# EAGLE design NJM2936+MAU106_PSU (EAGLE 7.2.0)
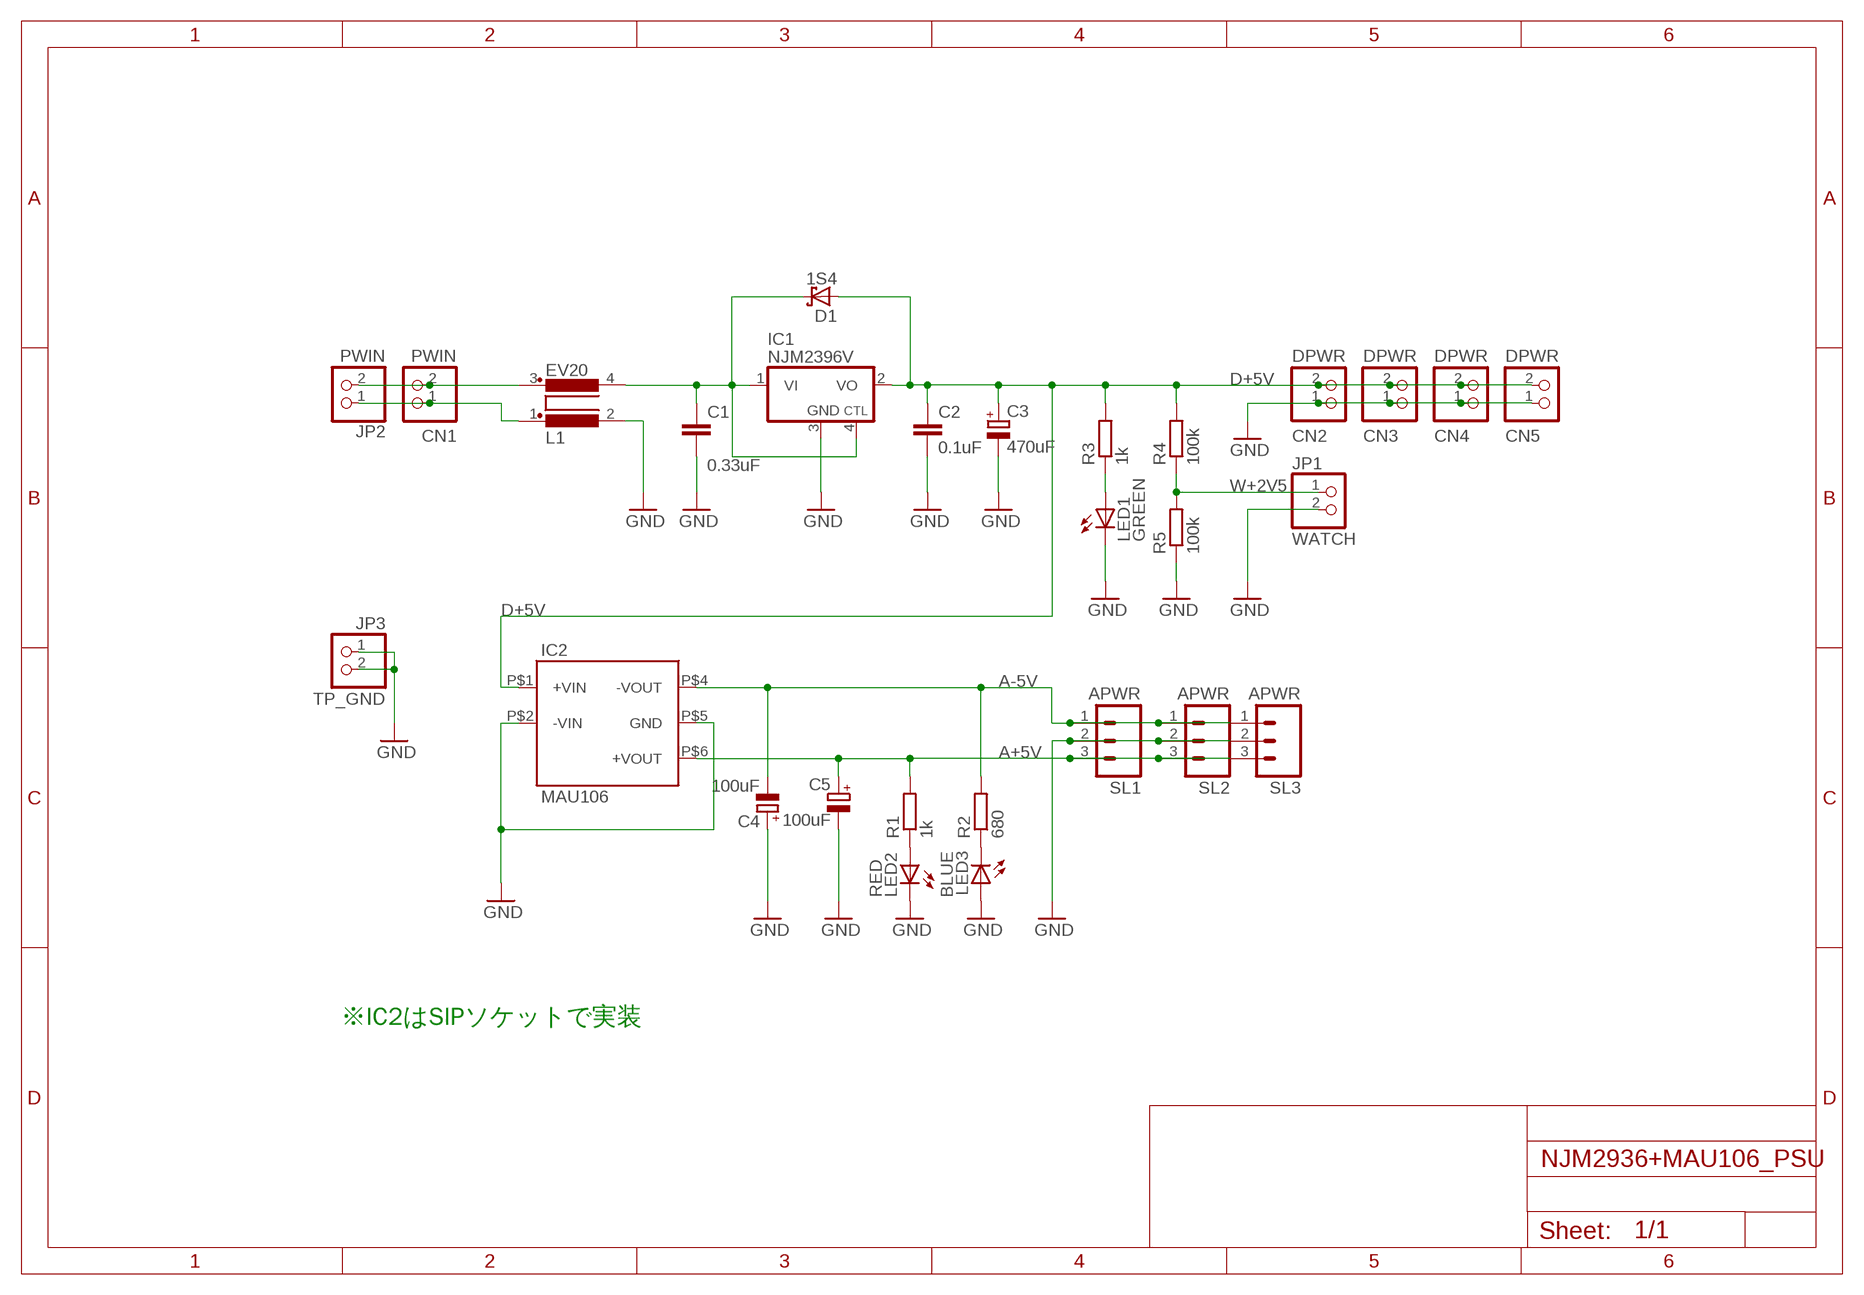
[diagram p0: schematic, sheet 1]

## Parts
C1  0.33uF  C-EU050-030X075  [C050-030X075]
C2  0.1uF  C-EU025-024X044  [C025-024X044]
C3  470uF  CPOL-EUSANYO_F13  [SANYO-OSCON_F13]
C4  100uF  CPOL-EUSANYO_C6  [SANYO-OSCON_C6]
C5  100uF  CPOL-EUSANYO_C6  [SANYO-OSCON_C6]
CN1  PWIN  B2B-XH-A  [B2B-XH-A]
CN2  DPWR  B2B-XH-A  [B2B-XH-A]
CN3  DPWR  B2B-XH-A  [B2B-XH-A]
CN4  DPWR  B2B-XH-A  [B2B-XH-A]
CN5  DPWR  B2B-XH-A  [B2B-XH-A]
D1  1S4  SCHOTTKY-DIODEDO35-7  [DO35-7]
IC1  NJM2396V  [TO220-4V]
IC2  MAU106  [MAU106]
JP1  WATCH  PINHD-1X2  [1X02]
JP2  PWIN  PINHD-1X2  [1X02]
JP3  TP_GND  PINHD-1X2  [1X02]
L1  EV20  [EV20]
LED1  GREEN  LED3MM  [LED3MM]
LED2  RED  LED3MM  [LED3MM]
LED3  BLUE  LED3MM  [LED3MM]
R1  1k  R-EU_0207/7  [0207/7]
R2  680  R-EU_0207/7  [0207/7]
R3  1k  R-EU_0207/7  [0207/7]
R4  100k  R-EU_0207/7  [0207/7]
R5  100k  R-EU_0207/7  [0207/7]
SL1  APWR  M03  [03P]
SL2  APWR  M03  [03P]
SL3  APWR  M03  [03P]

## Nets
A+5V: C5.+ IC2.P$6(+VOUT) R1.2 SL1.3 SL2.3 SL3.3
A-5V: C4.- IC2.P$4(-VOUT) R2.2 SL1.1 SL2.1 SL3.1
D+5V: C2.1 C3.+ CN2.2 CN3.2 CN4.2 CN5.2 D1.A IC1.2(VO) IC2.P$1(+VIN) R3.2 R4.2
GND: C1.2 C2.2 C3.- C4.+ C5.- CN2.1 CN3.1 CN4.1 CN5.1 IC1.3(GND) IC2.P$2(-VIN) IC2.P$5(GND) JP1.2 JP3.1 JP3.2 L1.2 LED1.K(C) LED2.K(C) LED3.A R5.1 SL1.2 SL2.2 SL3.2
N$1: CN1.2 JP2.2 L1.3
N$2: C1.1 D1.C IC1.1(VI) IC1.4(CTL) L1.4
N$3: CN1.1 JP2.1 L1.1
N$5: LED1.A R3.1
N$9: LED2.A R1.1
N$10: LED3.K(C) R2.1
W+2V5: JP1.1 R4.1 R5.2

## Notes on the sheet
- ※IC2はSIPソケットで実装

## Library data of the parts
C1 C2 = rcl:C-EU: CAPACITOR, European symbol
C3-C5 = rcl:CPOL-EU: POLARIZED CAPACITOR, European symbol
CN1-CN5 = jst-xh:B2B-XH-A: Wire-to-Board 2.5mm pitch top mount connector Source: http://www.jst-mfg.com/product/pdf/jpn/XH.pdf http://www.jst-mfg.com/product/detail.php?series=277
D1 = diode:SCHOTTKY-DIODE: Schottky Diode
IC1 = mylib2:NJM2396V: NJM2936 Vertical 5V LDO
IC2 = mylib2:MAU106: MAU106 Minmax MAU106 Dual Output DC/DC Converter
JP1-JP3 = pinhead:PINHD-1X2: PIN HEADER
L1 = mylib2:EV20: EV20 Schaffner Common-mode Choke
LED1-LED3 = led:LED: LED OSRAM: - CHIPLED LG R971, LG N971, LY N971, LG Q971, LY Q971, LO R971, LY R971 LH N974, LH R974 LS Q976, LO Q976, LY Q976 LO Q996 - Hyper CHIPLED LW Q18S LB Q993, LB Q99A, LB R99A - SideLED LS A670, LO A670, LY A670, LG A670, LP A670 LB A673, LV A673, LT A673, LW A673 LH A674 LY A675 LS A676, LA A676, LO A676, LY A676, LW A676 LS A679, LY A679, LG A679 - Hyper Micro SIDELED® LS Y876, LA Y876, LO Y876, LY Y876 LT Y87S - SmartLED LW L88C, LW L88S LB L89C, LB L89S, LG L890 LS L89K, LO L89K, LY L89K LS L896, LA L896, LO L896, LY L896 - TOPLED LS T670, LO T670, LY T670, LG T670, LP T670 LSG T670, LSP T670, LSY T670, LOP T670, LYG T670 LG T671, LOG T671, LSG T671 LB T673, LV T673, LT T673, LW T673 LH T674 LS T676, LA T676, LO T676, LY T676, LB T676, LH T676, LSB T676, LW T676 LB T67C, LV T67C, LT T67C, LS T67K, LO T67K, LY T67K, LW E67C LS E67B, LA E67B, LO E67B, LY E67B, LB E67C, LV E67C, LT E67C LW T67C LS T679, LY T679, LG T679 LS T770, LO T770, LY T770, LG T770, LP T770 LB T773, LV T773, LT T773, LW T773 LH T774 LS E675, LA E675, LY E675, LS T675 LS T776, LA T776, LO T776, LY T776, LB T776 LHGB T686 LT T68C, LB T68C - Hyper Mini TOPLED® LB M676 - Mini TOPLED Santana® LG M470 LS M47K, LO M47K, LY M47K Source: http://www.osram.convergy.de LUXEON: - LUMILED® LXK2-PW12-R00, LXK2-PW12-S00, LXK2-PW14-U00, LXK2-PW14-V00 LXK2-PM12-R00, LXK2-PM12-S00, LXK2-PM14-U00 LXK2-PE12-Q00, LXK2-PE12-R00, LXK2-PE12-S00, LXK2-PE14-T00, LXK2-PE14-U00 LXK2-PB12-K00, LXK2-PB12-L00, LXK2-PB12-M00, LXK2-PB14-N00, LXK2-PB14-P00, LXK2-PB14-Q00 LXK2-PR12-L00, LXK2-PR12-M00, LXK2-PR14-Q00, LXK2-PR14-R00 LXK2-PD12-Q00, LXK2-PD12-R00, LXK2-PD12-S00 LXK2-PH12-R00, LXK2-PH12-S00 LXK2-PL12-P00, LXK2-PL12-Q00, LXK2-PL12-R00 Source: www.luxeon.com KINGBRIGHT: KA-3528ASYC Source: www.kingbright.com
R1-R5 = rcl:R-EU_: RESISTOR, European symbol
SL1-SL3 = con-amp-quick:M03: AMP QUICK CONNECTOR; OC_FARNELL: unknown; OC_NEWARK: unknown

## Board
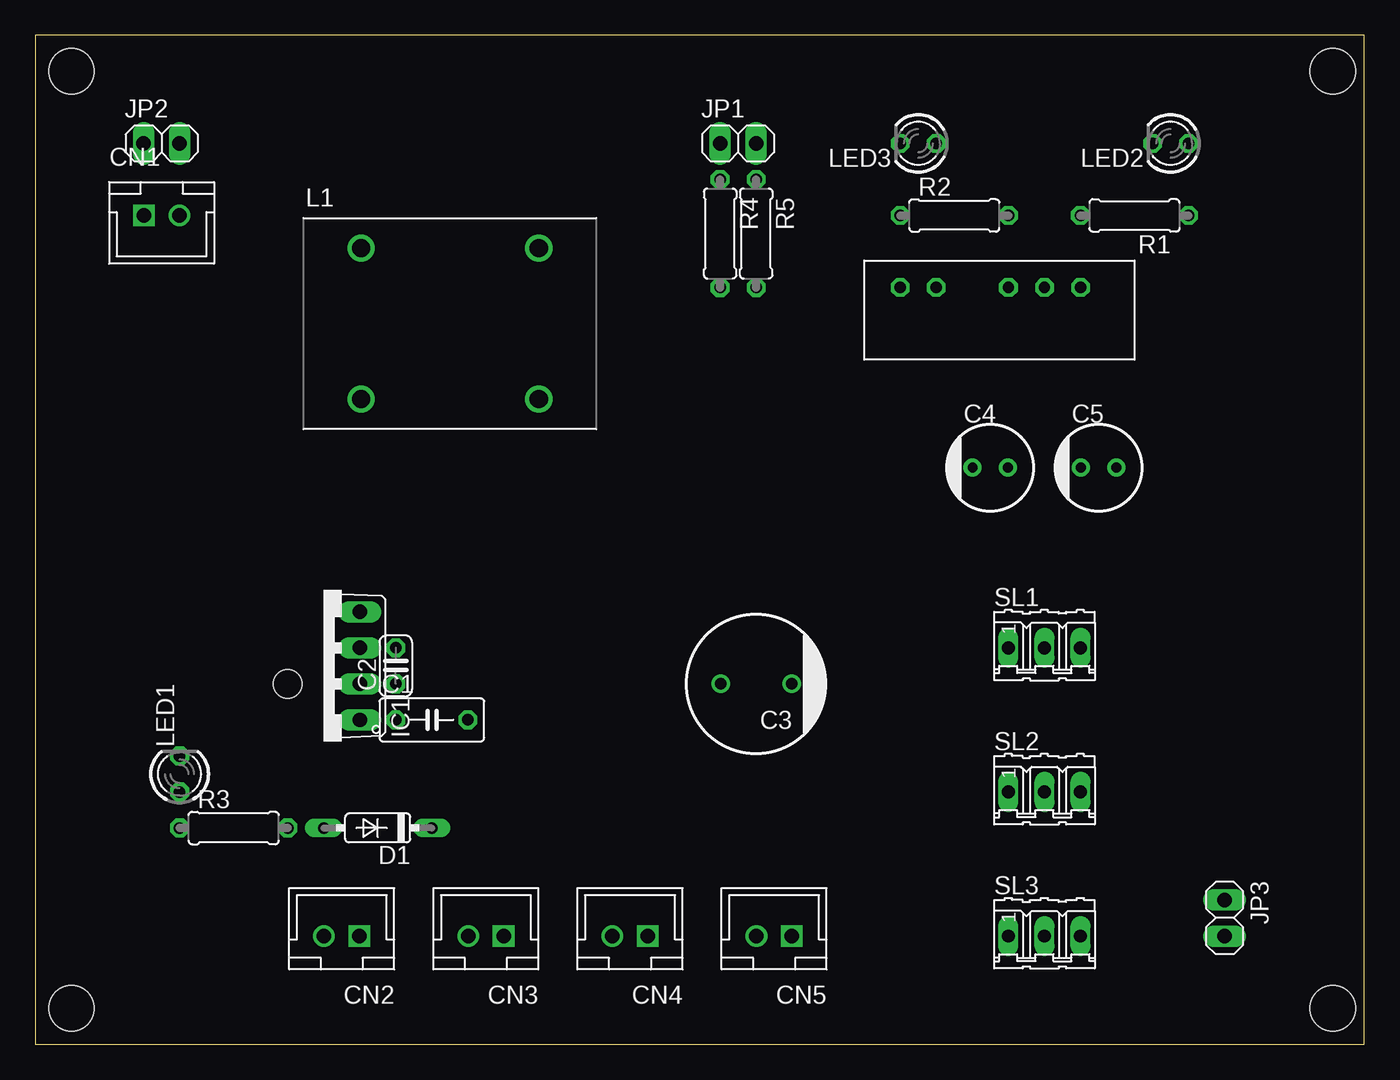
[diagram p1: board, top side]
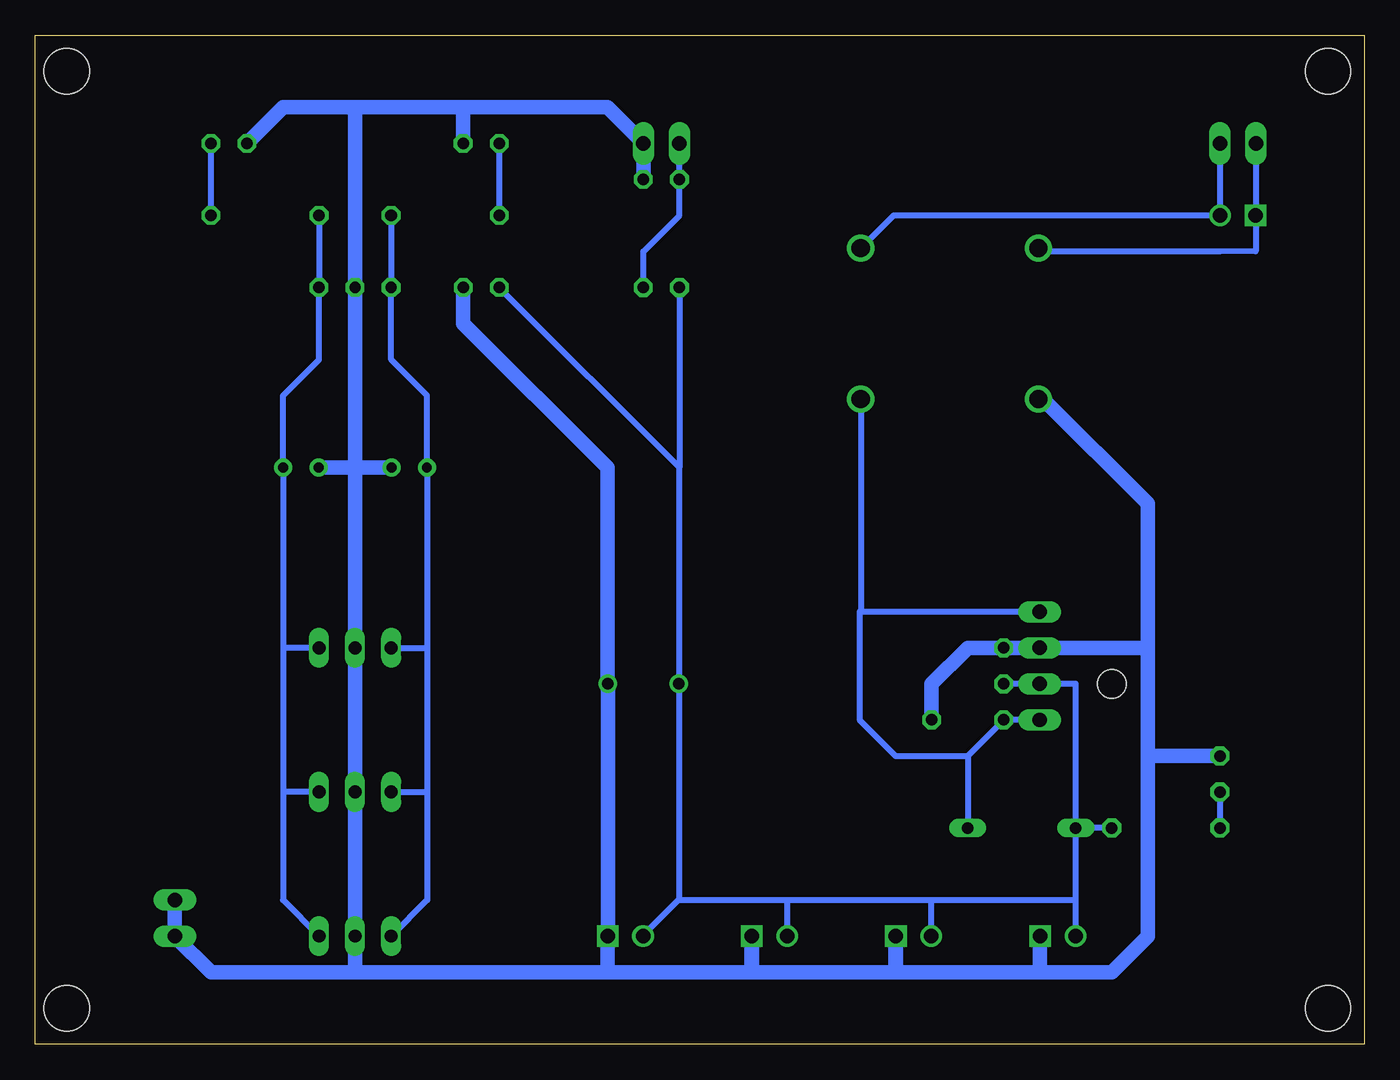
[diagram p2: board, bottom side, seen from below]

Size 93.65 x 71.11 mm. Coordinates in mm from the lower left corner, seen from the top.
Outline: 0,0 93.65,0 93.65,71.11 0,71.11 0,0
Copper layers (1*16): Top 0.035mm / dielectric 1.5mm / Bottom 0.035mm
Design rules "default": minimum track width 10mil, minimum drill 24mil, track to track 8mil, track to pad 8mil, pad to pad 8mil, via to via 8mil, smd to smd 8mil, copper to edge 40mil, drill to drill 8mil, minimum pad ring 10mil, minimum via ring 8mil, stop-mask expansion 4mil, vias tented up to drill 0mil, thermal gap 10mil
Holes 3.2 mm at 2.54,68.58 91.44,68.58 91.44,2.54 2.54,2.54
Holes 2 mm at 17.78,25.4

### Footprints (pad centres in the part's own frame; a part is rotated, then mirrored left to right if it is on the bottom)
C050-030X075 = drill 0.813 octagon: 1 -2.54,0; 2 2.54,0
C025-024X044 = drill 0.813 octagon: 1 -1.27,0; 2 1.27,0
SANYO-OSCON_F13 = drill 0.8 pad 1.27: + 2.5,0; - -2.5,0
SANYO-OSCON_C6 = drill 0.7 pad 1.27: + 1.25,0; - -1.25,0
B2B-XH-A = drill 1.016 square: 1 -1.25,0 | drill 1.016: 2 1.25,0
DO35-7 = drill 0.813 long: A 3.81,0; C -3.81,0
TO220-4V = drill 1.016 long: 1 -3.81,0; 2 -1.27,0; 3 1.27,0; 4 3.81,0
MAU106 = drill 0.8 octagon: P$1 -5.08,0; P$2 -2.54,0; P$4 2.54,0; P$5 5.08,0; P$6 7.62,0
1X02 = drill 1.016 long: 1 -1.27,0; 2 1.27,0
EV20 = drill 1.27: 1 -2.46,10.39; 2 -2.46,-0.23; 3 10.08,10.39; 4 10.08,-0.23
LED3MM = drill 0.813 octagon: A -1.27,0; K 1.27,0
0207/7 = drill 0.813 octagon: 1 -3.81,0; 2 3.81,0
03P = drill 0.914 long: 1 -2.54,0; 2 0,0; 3 2.54,0

### Placement (x,y rotation side)
C1  27.94,22.86 0 top
C2  25.4,26.67 90 top
C3  50.8,25.4 180 top
C4  67.31,40.64 0 top
C5  74.93,40.64 0 top
CN1  8.89,58.42 0 top
CN2  21.59,7.62 180 top
CN3  31.75,7.62 180 top
CN4  41.91,7.62 180 top
CN5  52.07,7.62 180 top
D1  24.13,15.24 180 top
IC1  22.86,26.67 90 top
IC2  66.04,53.34 0 top
JP1  49.53,63.5 0 top
JP2  8.89,63.5 0 top
JP3  83.82,8.89 270 top
L1  25.4,45.72 0 top
LED1  10.16,19.05 90 top
LED2  80.01,63.5 180 top
LED3  62.23,63.5 180 top
R1  77.47,58.42 180 top
R2  64.77,58.42 0 top
R3  13.97,15.24 0 top
R4  48.26,57.15 270 top
R5  50.8,57.15 270 top
SL1  71.12,27.94 0 top
SL2  71.12,17.78 0 top
SL3  71.12,7.62 0 top

### Tracks (layer width: path | path; a pad name or v marks a point on that pad's centre or on a via)
A+5V
  Bottom 0.406: R1.2 IC2.P$6 73.66,48.26 76.2,45.72 76.18,45.7 C5.+ 76.18,27.94 | 76.18,27.94 76.18,17.78 | 76.18,17.78 76.18,10.18 76.2,10.16 SL3.3 | SL2.3 76.18,17.78 | SL1.3 76.18,27.94
A-5V
  Bottom 0.406: R2.2 IC2.P$4 68.58,48.26 66.06,45.74 C4.- 66.06,27.94 | 66.06,27.94 66.06,17.78 | 66.06,17.78 66.06,10.18 66.04,10.16 SL3.1 | SL2.1 66.06,17.78 | SL1.1 66.06,27.94
D+5V
  Bottom 0.406: D1.A 20.32,25.4 IC1.2 C2.1 | D1.A 20.34,15.24 20.34,10.16 | 20.34,10.16 CN2.2 | CN3.2 30.48,7.62 30.48,10.16 | 30.48,10.16 20.34,10.16 | CN4.2 40.64,7.62 40.64,10.16 | 40.64,10.16 30.48,10.16 | CN5.2 50.8,7.62 50.8,7.7 48.3,10.2 | 40.64,10.16 48.26,10.16 48.3,10.2 | 48.3,10.2 C3.+ 48.26,25.44 48.26,40.64 | R3.2 D1.A | 48.26,40.64 IC2.P$1 | R4.2 48.26,40.64
GND
  Bottom 1.016: 53.34,5.08 53.34,7.62 CN5.1 53.3,7.64 C3.- 53.34,25.44 53.34,40.64 63.5,50.8 IC2.P$2 | 53.34,5.08 43.18,5.08 | 43.18,5.08 43.16,5.08 | 43.16,5.08 CN4.1 43.18,7.62 43.18,5.08 | 43.16,5.08 33.02,5.08 | 33.02,5.08 33,5.08 | 33,5.08 CN3.1 33.02,7.62 33.02,5.08 | 33,5.08 22.86,5.08 | 22.86,5.08 17.78,5.08 15.24,7.62 15.24,20.32 | C1.2 30.48,25.4 27.94,27.94 C2.2 IC1.3 15.24,27.94 | 15.24,20.32 15.24,27.94 | L1.2 22.63,45.49 15.24,38.1 15.24,27.94 | CN2.1 22.84,5.1 22.86,5.08 | R5.1 JP1.2 53.34,66.04 63.5,66.04 | 71.12,5.08 SL3.2 SL2.2 SL1.2 71.12,40.64 | 71.12,5.08 53.34,5.08 | 71.12,40.64 IC2.P$5 71.12,66.04 | C4.+ 71.12,40.64 | C5.- 71.12,40.64 | 71.12,66.04 76.2,66.04 LED2.K | 71.12,66.04 63.5,66.04 | LED3.A 63.5,66.04 | LED1.K 15.24,20.32 | 71.12,5.08 81.28,5.08 JP3.2 JP3.1
N$1
  Bottom 0.406: L1.3 33.17,58.42 CN1.2 10.16,58.44 JP2.2
N$2
  Bottom 0.406: IC1.1 C1.1 27.94,20.32 | 27.94,20.32 D1.C | IC1.4 35.56,30.48 | L1.4 35.48,30.56 35.56,30.48 | 35.56,30.48 35.56,22.86 33.02,20.32 27.94,20.32
N$3
  Bottom 0.406: L1.1 22.86,56.03 22.86,55.88 10.16,55.88 7.64,55.9 CN1.1 7.62,58.44 JP2.1
N$5
  Bottom 0.406: LED1.A R3.1
N$9
  Bottom 0.406: R1.1 LED2.A
N$10
  Bottom 0.406: LED3.K R2.1
W+2V5
  Bottom 0.406: JP1.1 R4.1 48.26,58.42 50.8,55.88 R5.2

### Text on the board
Document: Use SIP Socket